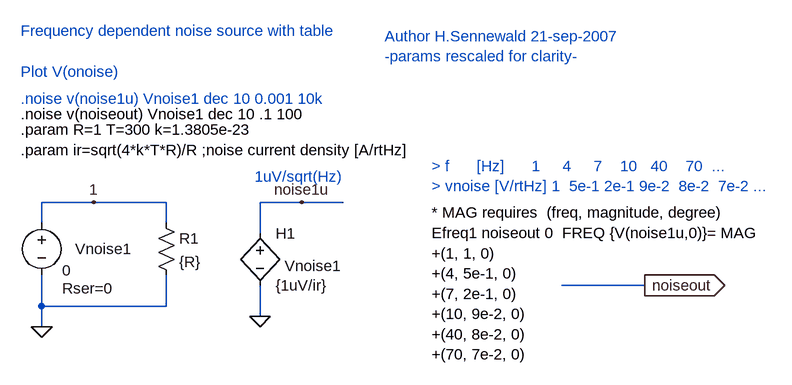
[diagram p0: schematic FreqDepNoiseGen.asc]
FreqDepNoiseGen.asc, the LTspice schematic file:
Version 4
SHEET 1 1176 680
WIRE 16 160 -64 160
WIRE 128 160 16 160
WIRE 336 160 272 160
WIRE 400 160 336 160
WIRE -64 192 -64 160
WIRE 128 192 128 160
WIRE 272 208 272 160
WIRE 864 288 736 288
WIRE -64 320 -64 272
WIRE 128 320 128 272
WIRE 128 320 -64 320
WIRE 272 336 272 288
WIRE -64 352 -64 320
FLAG -64 352 0
FLAG 272 336 0
FLAG 336 160 noise1u
FLAG 16 160 1
FLAG 864 288 noiseout
IOPIN 864 288 Out
SYMBOL h 272 192 R0
WINDOW 38 38 66 Left 0
SYMATTR SpiceModel Vnoise1
SYMATTR InstName H1
SYMATTR Value {1uV/ir}
SYMBOL voltage -64 176 R0
WINDOW 0 52 56 Left 0
WINDOW 3 32 89 Left 0
WINDOW 123 0 0 Left 0
WINDOW 39 32 117 Left 0
SYMATTR InstName Vnoise1
SYMATTR Value 0
SYMATTR SpiceLine Rser=0
SYMBOL res 112 176 R0
SYMATTR InstName R1
SYMATTR Value {R}
TEXT -96 0 Left 0 ;.noise v(noise1u) Vnoise1 dec 10 0.001 10k
TEXT -96 -104 Left 0 ;Frequency dependent noise source with table\n \nPlot V(onoise)
TEXT 264 120 Left 0 ;1uV/sqrt(Hz)
TEXT 536 176 Left 0 !* MAG requires  (freq, magnitude, degree)\nEfreq1 noiseout 0  FREQ {V(noise1u,0)}= MAG\n+(1, 1, 0)\n+(4, 5e-1, 0)  \n+(7, 2e-1, 0)  \n+(10, 9e-2, 0)  \n+(40, 8e-2, 0)  \n+(70, 7e-2, 0)
TEXT 536 104 Left 0 ;> f      [Hz]      1     4     7    10   40    70  ...\n> vnoise [V/rtHz] 1  5e-1 2e-1 9e-2  8e-2  7e-2 ...
TEXT -96 24 Left 0 !.noise v(noiseout) Vnoise1 dec 10 .1 100
TEXT -96 48 Left 0 !.param R=1 T=300 k=1.3805e-23\n.param ir=sqrt(4*k*T*R)/R ;noise current density [A/rtHz]
TEXT 464 -96 Left 0 ;Author H.Sennewald 21-sep-2007\n-params rescaled for clarity-

The netlist it stands for:
* FreqDepNoiseGen.asc
H1 noise1u 0 Vnoise1 {1uV/ir}
Vnoise1 1 0 0 Rser=0
R1 1 0 {R}
* .noise v(noise1u) Vnoise1 dec 10 0.001 10k
* Frequency dependent noise source with table
* Plot V(onoise)
* 1uV/sqrt(Hz)
* MAG requires  (freq, magnitude, degree)
Efreq1 noiseout 0  FREQ {V(noise1u,0)}= MAG
+(1, 1, 0)
+(4, 5e-1, 0)
+(7, 2e-1, 0)
+(10, 9e-2, 0)
+(40, 8e-2, 0)
+(70, 7e-2, 0)
* > f      [Hz]      1     4     7    10   40    70  ...
* > vnoise [V/rtHz] 1  5e-1 2e-1 9e-2  8e-2  7e-2 ...
.noise v(noiseout) Vnoise1 dec 10 .1 100
.param R=1 T=300 k=1.3805e-23
.param ir=sqrt(4*k*T*R)/R ;noise current density [A/rtHz]
* Author H.Sennewald 21-sep-2007
* -params rescaled for clarity-
.backanno
.end